# Altium schematic sheet LEDs.SchDoc
size Letter
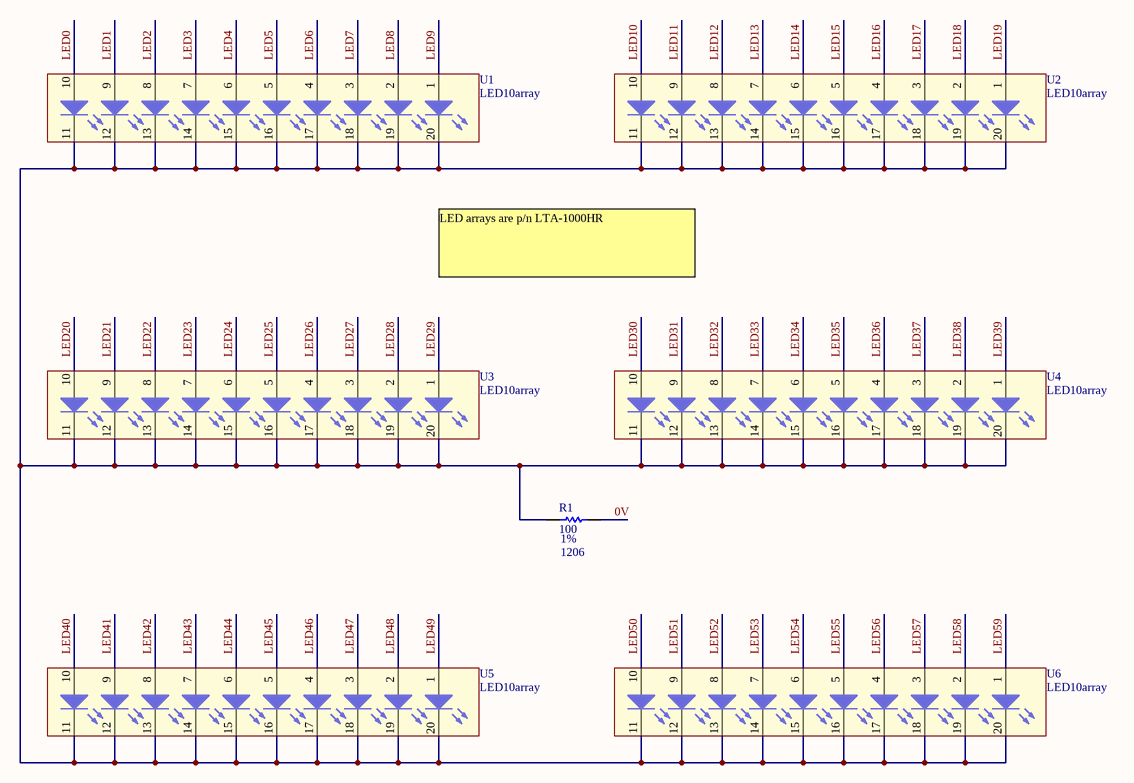
[diagram p0: LEDs.SchDoc]

## Parts
R1  100  Param: 1%  [1206]
U1  LED10array  [LED10array]
U2  LED10array  [LED10array]
U3  LED10array  [LED10array]
U4  LED10array  [LED10array]
U5  LED10array  [LED10array]
U6  LED10array  [LED10array]

## Nets
0V: R1.2
LED0: U1.10
LED1: U1.9
LED2: U1.8
LED3: U1.7
LED4: U1.6
LED5: U1.5
LED6: U1.4
LED7: U1.3
LED8: U1.2
LED9: U1.1
LED10: U2.10
LED11: U2.9
LED12: U2.8
LED13: U2.7
LED14: U2.6
LED15: U2.5
LED16: U2.4
LED17: U2.3
LED18: U2.2
LED19: U2.1
LED20: U3.10
LED21: U3.9
LED22: U3.8
LED23: U3.7
LED24: U3.6
LED25: U3.5
LED26: U3.4
LED27: U3.3
LED28: U3.2
LED29: U3.1
LED30: U4.10
LED31: U4.9
LED32: U4.8
LED33: U4.7
LED34: U4.6
LED35: U4.5
LED36: U4.4
LED37: U4.3
LED38: U4.2
LED39: U4.1
LED40: U5.10
LED41: U5.9
LED42: U5.8
LED43: U5.7
LED44: U5.6
LED45: U5.5
LED46: U5.4
LED47: U5.3
LED48: U5.2
LED49: U5.1
LED50: U6.10
LED51: U6.9
LED52: U6.8
LED53: U6.7
LED54: U6.6
LED55: U6.5
LED56: U6.4
LED57: U6.3
LED58: U6.2
LED59: U6.1
NetR1_1: R1.1 U1.11 U1.12 U1.13 U1.14 U1.15 U1.16 U1.17 U1.18 U1.19 U1.20 U2.11 U2.12 U2.13 U2.14 U2.15 U2.16 U2.17 U2.18 U2.19 U2.20 U3.11 U3.12 U3.13 U3.14 U3.15 U3.16 U3.17 U3.18 U3.19 U3.20 U4.11 U4.12 U4.13 U4.14 U4.15 U4.16 U4.17 U4.18 U4.19 U4.20 U5.11 U5.12 U5.13 U5.14 U5.15 U5.16 U5.17 U5.18 U5.19 U5.20 U6.11 U6.12 U6.13 U6.14 U6.15 U6.16 U6.17 U6.18 U6.19 U6.20

## Notes on the sheet
- LED arrays are p/n LTA-1000HR

## Library data of the parts
R1 = Res1206: Resistor; Param1: 100ppm/C; Value: DNL; TechInfo: *